# Altium schematic sheet ADC_Ref.SchDoc
size A4; CompanyName: TH Nürnberg; Organization: UltraZohm; Address1: Kesslerplatz 12; Address2: 90489 Nürnberg; Address3: GERMANY; SheetNumber: 8; SheetTotal: 10
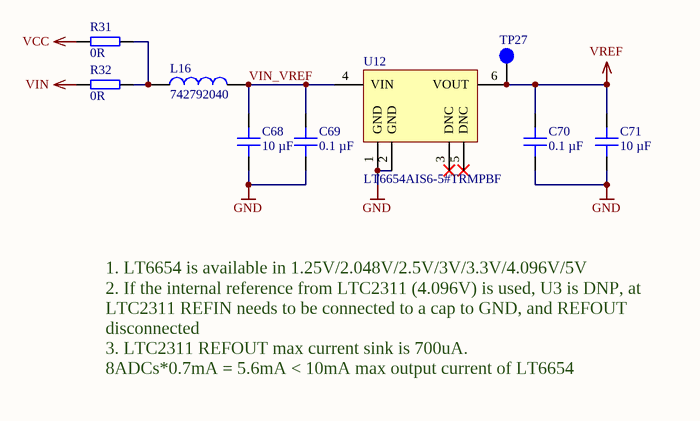
[diagram p0: ADC_Ref.SchDoc]

## Parts
C68  10 µF  [C_1206]
C69  0.1 µF  [C_0603]
C70  0.1 µF  [C_0603]
C71  10 µF  [C_1206]
L16  742792040  [WE-CBF_0805_High Current]
R31  0R  [RES 0603_1608]
R32  0R  [RES 0603_1608]
TP27  -  [TP_1mm]  (value not drawn)
U12  LT6654AIS6-5#TRMPBF  [SOT95P280X100-6N]

## Nets
GND: C68.1 C69.1 C70.1 C71.1 U12.1(GND) U12.2(GND)
VCC: R31.1
VIN: R32.1
VREF: C70.2 C71.2 TP27.1 U12.6(VOUT)
VIN_VREF: C68.2 C69.2 L16.2 U12.4(VIN)
NetL16_1: L16.1 R31.2 R32.2

Not connected (* = marked no-connect by the designer): U12 3(DNC)* 5(DNC)*

## Notes on the sheet
- 1. LT6654 is available in 1.25V/2.048V/2.5V/3V/3.3V/4.096V/5V
  2. If the internal reference from LTC2311 (4.096V) is used, U3 is DNP, at LTC2311 REFIN needs to be connected to a cap to GND, and REFOUT disconnected
  3. LTC2311 REFOUT max current sink is 700uA.
  8ADCs*0.7mA = 5.6mA < 10mA max output current of LT6654
- Title
- Revision:
- Design Engineer:
- Date:
- Project:
- Sheet
- of

## Library data of the parts
C68 C71 = 1206DD106MAT2A: Capacitor 1206, 35 VDC, 10 µF, X5R; Manufacturer: AVX; Tolerance: 20%; Voltage Rating: 35 VDC; Created from: MGremer; Manufacturer Part Number: 1206DD106MAT2A; PartID: 49; Created On: 20.12.2020 13:54:13; ComponentLink1Description: Datasheet; ComponentLink1URL: https://www.mouser.de/datasheet/2/40/cx5r-776519.pdf; Component Type: Capacitor 1206; Device Package: 1206; Last Updated: 20.12.2020 17:44:37; Mounting Type: SMD; Operating Temperature: -55 - 85°C; Series: X5R; Supplier 1: Mouser; Supplier Part Number 1: 581-1206DD106MAT2A; Type: Capacitor; Value: 10 µF; Live Cycle Status: 1; Stock number: not stored
C69 C70 = C0603X104K5RAC7411: Capacitor 0603, 50 VDC, 0.1 µF, X7R; Manufacturer: KEMET; Tolerance: 10 %; Voltage Rating: 50 VDC; Created from: MGremer; Manufacturer Part Number: C0603X104K5RAC7411; PartID: 3; Created On: 20.12.2020 13:54:13; ComponentLink1Description: Datasheet; ComponentLink1URL: https://www.mouser.de/datasheet/2/212/1/KEM_C1013_X7R_FT_CAP_SMD-1103280.pdf; Component Type: Capacitor 0603; Device Package: 0603; Last Updated: 04.03.2021 09:24:28; Mounting Type: SMD; Operating Temperature: -55 - 125°C; Series: SMD Comm X7R Flex; Supplier 1: Mouser; Supplier Part Number 1: 80-C0603X104K5R7411; Supplier 2: LCSC; Supplier Part Number 2: C14663; Type: Capacitor; Value: 0.1 µF; Live Cycle Status: 1; LCSC Part Number: C14663; Stock number: Labor SMD Container
L16 = 742792040: Inductance, 0805, 100 MHz, 600 Ohm, 2 A; Manufacturer: Wurth Elektronik; Type: Inductance SMD; DC current: 2 A; Value: 600 Ohm; Created from: MGremer; Manufacturer Part Number: 742792040; PartID: 1; Created On: 18.01.2021 14:53:17; ComponentLink1Description: Datasheet; ComponentLink1URL: https://www.mouser.de/datasheet/2/445/742792040-1720361.pdf; Component Type: Inductance; Device Package: 0805; Last Updated: 18.01.2021 14:53:25; Mounting Type: SMD; Operating Temperature: -55 - 125 °C; Series: WE-CBF; Supplier 1: Mouser; Supplier Part Number 1: 710-742792040; Live Cycle Status: 1; Stock number: not stored
R31 R32 = RC0603JR-070RL: SMD resistor E24 series; Manufacturer: YAGEO; Tolerance: 5%; Created from: MGremer; Manufacturer Part Number: RC0603JR-070RL; PartID: 1; Created On: 14.12.2020 16:17:14; ComponentLink1Description: Datasheet; ComponentLink1URL: https://www.mouser.de/datasheet/2/447/PYu-RC_Group_51_RoHS_L_10-1664068.pdf; Component Type: SMD resistor; Device Package: 0603; Last Updated: 04.03.2021 09:09:42; Mounting Type: SMD; Supplier 1: Mouser; Supplier Part Number 1: 603-RC0603JR-070RL; Supplier 2: LCSC; Supplier Part Number 2: C21189; Type: Resistor; Value: 0R; Live Cycle Status: 1; Stock number: Labor SMD Container; LCSC Part Number: C21189
TP27 = -: Test Point 1 mm; Value: TP; Created from: MGremer; Created: 2018_06_25_AGeiger; Manufacturer Part Number: -; PartID: 9; Created On: 02.03.2021 14:59:37; ComponentLink1Description: Datasheet; ComponentLink1URL: -; ComponentLink2Description: Homepage; ComponentLink2URL: -; Component Type: Test Point; Device Package: SMD; Last Updated: 08.10.2021 21:16:06; Manufacturer: -; Minimum Order: 1; Mounting Type: SMD; Supplier 1: -; Supplier Part Number 1: -; Type: Test point; Live Cycle Status: 1; Stock number: not stored
U12 = LT6654AIS6-5#TRMPBF: Precision Wide Supply High Output Drive Low Noise Reference, 5 V; Manufacturer: Analog Devices; Value: 5 V; Created from: MGremer; Manufacturer Part Number: LT6654AIS6-5#TRMPBF; PartID: 9; Created On: 06.01.2021 09:48:37; ComponentLink1Description: Datasheet; ComponentLink1URL: https://www.mouser.de/datasheet/2/609/6654fh-1266957.pdf; Component Type: Precision Wide Supply; Device Package: -; Last Updated: 15.02.2021 10:14:22; Mounting Type: SMD; Operating Temperature: -40 - 85 °C; Series: LT6654; Supplier 1: Mouser; Supplier Part Number 1: 584-6654AIS65TRMPBF; Type: Precision Wide Supply; Live Cycle Status: 1; Stock number: not stored